# Altium schematic sheet stepper_cfg.SchDoc
size A4; SheetNumber: 3; SheetTotal: 5
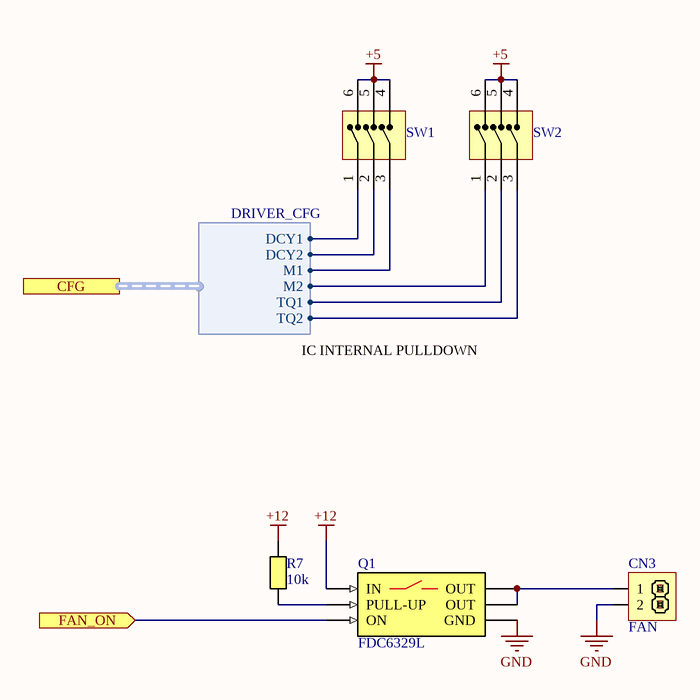
[diagram p0: stepper_cfg.SchDoc]

## Parts
CN3  FAN  [XH2.54 2P]
Q1  FDC6329L  [SuperSOT-6]
R7  10k  [RESC0603(1608)_N]
SW1  DIP Switch 6P  [DIP Switch 6P]  (value not drawn)
SW2  DIP Switch 6P  [DIP Switch 6P]  (value not drawn)

## Ports
CFG (harness DRIVER_CFG), FAN_ON (in)

## Harnesses
DRIVER_CFG: DCY1, DCY2, M1, M2, TQ1, TQ2

## Nets
+5: SW1.4 SW1.5 SW1.6 SW2.4 SW2.5 SW2.6
+12: Q1.4(IN) R7.2
GND: CN3.2 Q1.1(GND)
FAN_ON: Q1.5(ON) ; port FAN_ON
NetCN3_1: CN3.1 Q1.2(OUT) Q1.3(OUT)
NetQ1_6: Q1.6(PULL-UP) R7.1
NetSW1_1: SW1.1 ; port CFG.DCY1
NetSW1_2: SW1.2 ; port CFG.DCY2
NetSW1_3: SW1.3 ; port CFG.M1
NetSW2_1: SW2.1 ; port CFG.M2
NetSW2_2: SW2.2 ; port CFG.TQ1
NetSW2_3: SW2.3 ; port CFG.TQ2

## Notes on the sheet
- IC INTERNAL PULLDOWN

## Library data of the parts
CN3 = PIN HEADER 2.54 1x2
Q1 = FDC6329L: 2A Integrated Load Switch SuperSOT-6 SMD
R7 = Resistor M: Resistor Medium Density; Value: 10k